# EAGLE schematic Mainboard (EAGLE 6.2)
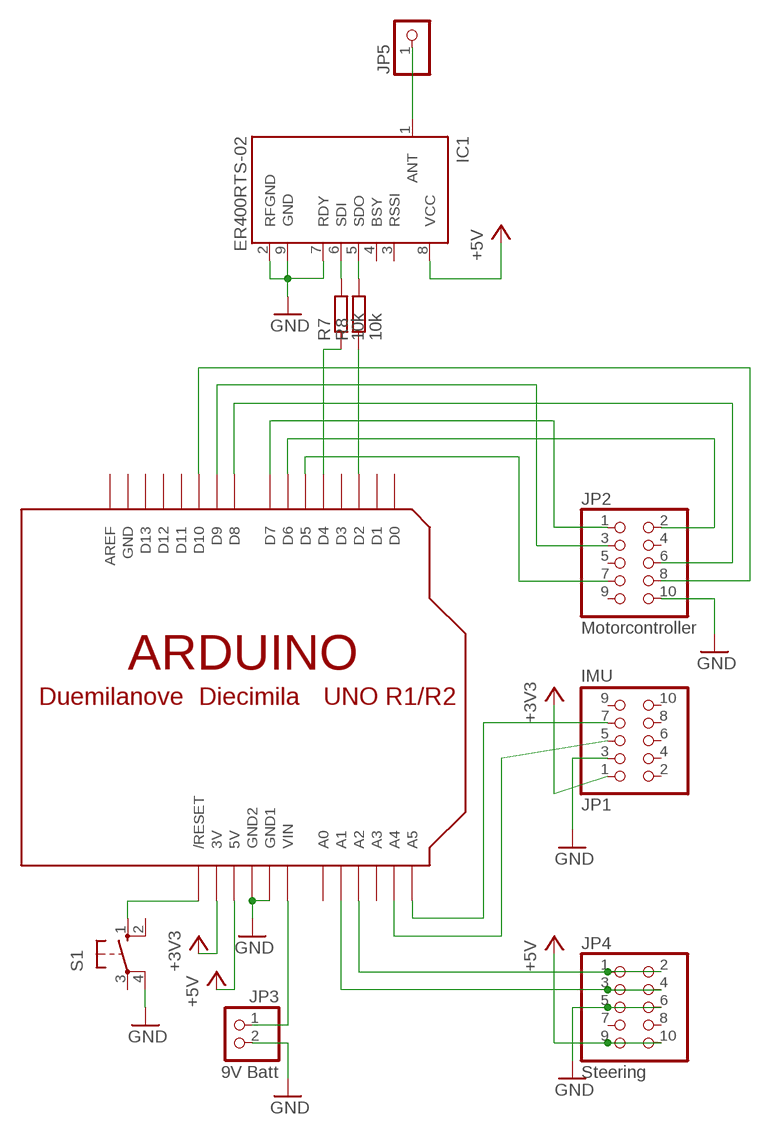
[diagram p0: schematic, sheet 1]

## Parts
IC1  ER400RTS-02  [SIL9]
JP1  IMU  PINHD-2X5  [2X05]
JP2  Motorcontroller  PINHD-2X5  [2X05]
JP3  9V Batt  PINHD-1X2  [1X02]
JP4  Steering  PINHD-2X5  [2X05]
JP5  PINHD-1X1  [1X01]
R7  10k  R-EU_0207/10  [0207/10]
R8  10k  R-EU_0207/10  [0207/10]
S1  10-XX  [B3F-10XX]
U$1  ARDUINOUNO  [ARDUINO]

## Nets
+3V3: JP1.1 U$1.3V
+5V: IC1.8(VCC) JP4.9 JP4.10 U$1.5V
GND: IC1.2(RFGND) IC1.7(RDY) IC1.9(GND) JP1.3 JP2.10 JP3.2 JP4.5 JP4.6 S1.4(P1) U$1.GND1 U$1.GND2
N$1: JP2.1 U$1.D7
N$4: JP2.2 U$1.D6
N$5: JP2.6 U$1.D8
N$6: JP2.8 U$1.D10
N$8: JP2.3 U$1.D9
N$9: R8.1 U$1.D2
N$12: R7.1 U$1.D4
N$13: JP4.3 JP4.4 U$1.A1
N$14: JP4.1 JP4.2 U$1.A2
N$15: S1.1(S) U$1.RESET(/RESET)
N$16: JP2.7 U$1.D5
N$18: IC1.5(SDO) R8.2
N$19: IC1.6(SDI) R7.2
N$21: IC1.1(ANT) JP5.1
N$26: JP1.7 U$1.A5
N$39: JP3.1 U$1.VIN
N$41: JP1.5 U$1.A4
Unconnected: IC1.3(RSSI) IC1.4(BSY) JP1.2 JP1.4 JP1.6 JP1.8 JP1.9 JP1.10 JP2.4 JP2.5 JP2.9 JP4.7 JP4.8 S1.2(S1) S1.3(P) U$1.A0 U$1.A3 U$1.AREF U$1.D0 U$1.D1 U$1.D3 U$1.D11 U$1.D12 U$1.D13

## Power pins joined to a net without a drawn wire
GND: U$1.GND

## Library data of the parts
IC1 = lprs:ER*00RTS-02: Easy-Radio '02' (2nd Generation Modules) Transceiver Source: http://www.lprs.co.uk/pdf_directory/2386mylprs1132229147er-datasheet-2.3-sept-05.pdf; MPN: ER400RS; OC_FARNELL: 5096522; OC_NEWARK: 13J9292
JP1 JP2 JP4 = pinhead:PINHD-2X5: PIN HEADER
JP3 = pinhead:PINHD-1X2: PIN HEADER
JP5 = adafruit:PINHD-1X1: Pin header 1x1 for 0.1" spacing With round pins
R7 R8 = rcl:R-EU_: RESISTOR, European symbol
S1 = switch-omron:10-XX: OMRON SWITCH; MPN: B3F-1000; OC_FARNELL: 176432; OC_NEWARK: 36M3542
U$1 = adafruit:ARDUINO: Arduino Diecimila/Duemilanove Make a shield with ease, this package has all the named pins as well as the two mounting drill holes and an outline of the USB and DC power connector. The outline is on the DIMENSION layer, so if your board house uses it they will cut the outline to match. http://www.ladyada.net/library/pcb/eaglelibrary.html